# EAGLE design gatilhobaixocusto (EAGLE 7.5.0)
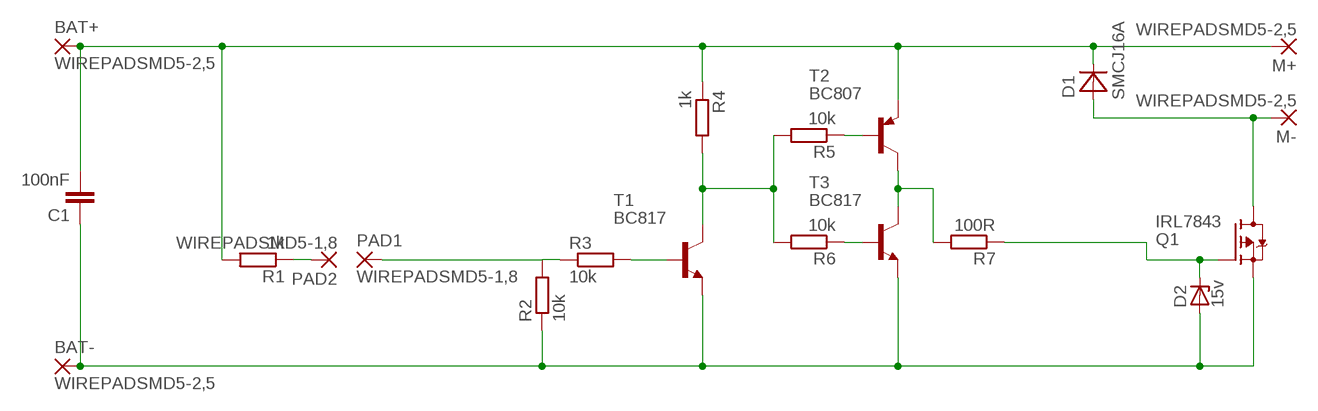
[diagram p0: schematic, sheet 1]

## Parts
BAT+  WIREPADSMD5-2,5  [5-2,5]
BAT-  WIREPADSMD5-2,5  [5-2,5]
C1  100nF  C-EUC0805K  [C0805K]
D1  SMCJ16A  MBRA340T3  [SMA]
D2  15v  ZENER-DIODESOD80C  [SOD80C]
M+  WIREPADSMD5-2,5  [5-2,5]
M-  WIREPADSMD5-2,5  [5-2,5]
PAD1  WIREPADSMD5-1,8  [5-1,8]
PAD2  WIREPADSMD5-1,8  [5-1,8]
Q1  IRL7843  FDD4141TO252  [TO252]
R1  1k  R-EU_R0805  [R0805]
R2  10k  R-EU_R0805  [R0805]
R3  10k  R-EU_R0805  [R0805]
R4  1k  R-EU_R0805  [R0805]
R5  10k  R-EU_R0805  [R0805]
R6  10k  R-EU_R0805  [R0805]
R7  100R  R-EU_R0805  [R0805]
T1  BC817  MMBT3904LT1-NPN-SOT23-BEC  [SOT23-BEC]
T2  BC807  MMBT3906LT1-PNP-SOT23-BEC  [SOT23-BEC]
T3  BC817  MMBT3904LT1-NPN-SOT23-BEC  [SOT23-BEC]

## Nets
N$1: BAT-.1(P) C1.1 D2.A Q1.2(S) R2.1 T1.E T3.E
N$2: D1.A M-.1(P) Q1.3(D)
N$4: PAD2.1(P) R1.1
N$5: BAT+.1(P) C1.2 D1.C M+.1(P) R1.2 R4.1 T2.E
N$7: PAD1.1(P) R2.2 R3.1
N$11: R4.2 R5.2 R6.2 T1.C
N$12: R3.2 T1.B
N$13: R7.2 T2.C T3.C
N$15: R5.1 T2.B
N$16: R6.1 T3.B
N$17: D2.C Q1.1(G) R7.1

## Library data of the parts
BAT+ BAT- M+ M- PAD1 PAD2 = wirepad:WIREPAD: Wire PAD connect wire on PCB
C1 = rcl:C-EU: CAPACITOR, European symbol
D1 = diode:MBRA340T3: Surface Mount Schottky Power Rectifier Source: http://www.onsemi.com/pub_link/Collateral/MBRA340T3-D.PDF
D2 = diode:ZENER-DIODE: Z-Diode
Q1 = transistor-fet:FDD4141: P-Channel PowerTrench® MOSFET Source: FDD4141.pdf
R1-R7 = resistor:R-EU_: RESISTOR, European symbol
T1 T3 = transistor-neu-to92:*-NPN-: NPN Transistror
T2 = transistor:*-PNP-: PNP Transistror

## Board
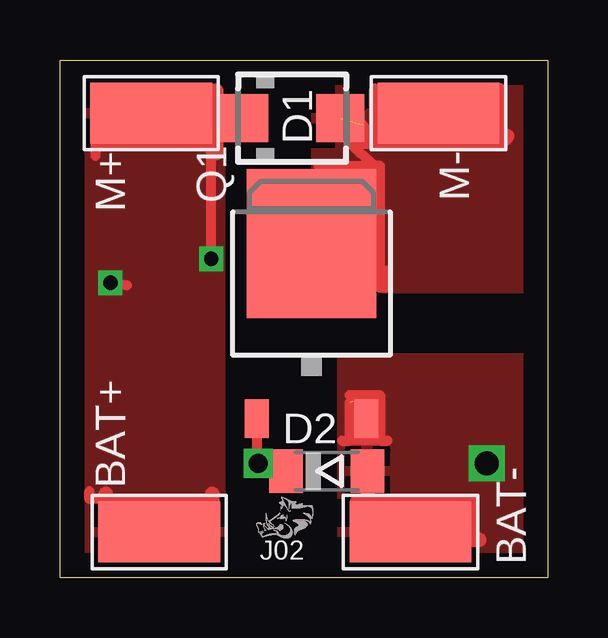
[diagram p1: board, top side]
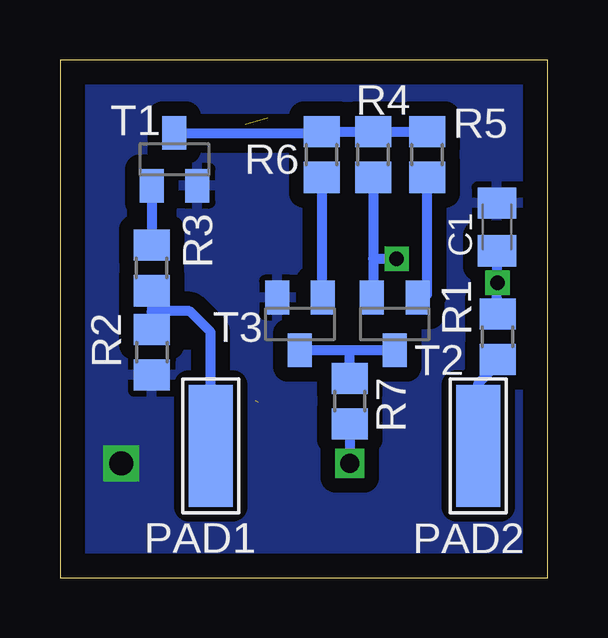
[diagram p2: board, bottom side, seen from below]

Size 20.33 x 21.59 mm. Coordinates in mm from the lower left corner, seen from the top.
Outline: 20.32,21.59 0,21.59 0,0 20.32,0
Outline: 20.33,21.59 20.33,0
Copper layers (1*16): Top 0.035mm / dielectric 1.5mm / Bottom 0.035mm
Design rules "default": minimum track width 10mil, minimum drill 24mil, track to track 8mil, track to pad 8mil, pad to pad 8mil, via to via 8mil, smd to smd 8mil, copper to edge 40mil, drill to drill 8mil, minimum pad ring 10mil, minimum via ring 8mil, stop-mask expansion 4mil, vias tented up to drill 0mil, thermal gap 10mil

### Footprints (pad centres in the part's own frame; a part is rotated, then mirrored left to right if it is on the bottom)
5-2,5 = smd 2.54 x 5.08: 1 0,0
C0805K = smd 1.3 x 1.6: 1 -1,0; 2 1,0
SMA = smd 2 x 2: A 2,0; C -2,0
SOD80C = smd 1.4 x 1.8: A 1.7,0; C -1.7,0
5-1,8 = smd 1.829 x 5.08: 1 0,0
TO252 = smd 1 x 1.6: 1 -2.28,-4.8; 2 2.28,-4.8 | smd 5.4 x 6.2: 3 0,2.5
R0805 = smd 1.3 x 1.5: 1 -0.95,0; 2 0.95,0
SOT23-BEC = smd 1 x 1.4: B -0.95,-1.1; C 0,1.1; E 0.95,-1.1

### Placement (x,y rotation side)
BAT+  4.13,1.91 90 top
BAT-  14.61,1.91 270 top
C1  2.12,14.63 270 bottom
D1  9.67,19.16 0 top
D2  11.11,4.45 0 top
M+  3.81,19.37 90 top
M-  15.77,19.37 270 top
PAD1  14.05,5.5 180 bottom
PAD2  2.9,5.5 0 bottom
Q1  10.48,11.43 0 top
R1  2.09,10.05 90 bottom
R2  16.5,9.4 90 bottom
R3  16.51,12.92 90 bottom
R4  7.29,17.65 90 bottom
R5  5.03,17.65 90 bottom
R6  9.43,17.65 90 bottom
R7  8.26,7.36 90 bottom
T1  15.56,17.45 0 bottom
T2  6.38,10.58 180 bottom
T3  10.33,10.58 180 bottom

### Tracks (layer width: path | path; a pad name or v marks a point on that pad's centre or on a via)
N$1  (via drill 1)  (1 unrouted)
  Top 0.406: 13.34,5.71 13.65,5.71 | 12.06,7.62 13.34,7.62 13.34,5.71 | 13.34,5.71 12.06,5.71 | 12.06,5.71 12.06,7.3 | 11.75,5.71 12.06,5.71 | 12.19,7.37 12.19,7.11
  Top 0.61: 12.38,3.17 12.7,3.17 | 12.7,3.17 17.14,3.17 17.14,1.59 | D2.A 12.81,3.29 12.7,3.17 | 17.14,1.59 17.46,1.59 | 16.83,1.59 17.14,1.59
  other vias: 17.78,4.76
  pour Top: 11.75,0.32 19.37,0.32 19.37,9.14 11.75,9.14
  pour Bottom (isolate 0.61): 19.37,21.27 19.37,0.32 0.64,0.32 0.64,21.27
N$2  (1 unrouted)
  Top 0.406: 10.78,17.18 13.12,17.18 | 12.87,12.69 12.87,12.78 13.6,12.8 13.58,12.08 13.33,12.08 13.33,17.18 13.12,17.18 | 13.1,20.4 13.1,18.4 12.91,18.59 | 13.12,17.18 12.1,18.1 13.3,18.1 | 12.91,18.41 12.91,18.59 | 12.91,18.59 12.6,18.9
  Top 0.61: 18.31,18.1 13.3,18.1 13.23,18.1 13.23,18.41 12.91,18.41 | 18.31,18.1 18.31,20.32 | 18.63,18.41 18.31,18.1
  pour Top: 10.66,21.27 10.64,12.08 19.37,12.08 19.37,21.27
N$4
  Bottom 0.406: PAD2.1 2.9,8.11 2.1,8.9 R1.1
N$5  (via drill 0.6)
  Top 0.406: 1.77,18.25 1.47,18.25 1.47,17.59 | 2.23,3.29 1.22,3.29 1.22,3.61 | 1.5,18 5.5,18 | 5.5,18 6.1,18 | 6.1,18 6.2,18 6.2,17.9 | v6.3,13.3 6.3,17.8 | 6.3,17.8 6.1,18 | D1.C 5.44,19.16 5,19.6 5,18.5 5.5,18 | 6.3,17.8 6.5,17.8 | v2.1,12.3 2.8,12.2
  Top 0.61: 6.35,3.17 4.45,3.17 | 4.45,3.17 1.91,3.17 | BAT+.1 4.13,2.86 4.45,3.17 | 1.91,3.17 1.91,3.49 | 1.91,3.17 1.91,2.86 | 6.35,3.17 6.35,3.49 | 6.35,3.17 6.35,2.86 | 6.5,20.3 6.5,17.8 6.5,17.7
  Bottom 0.406: R4.1 7.29,13.3 | 7.29,13.3 7.29,11.74 T2.E | 7.29,13.3 v6.3,13.3 | R1.2 2.12,11.63 2.12,12.18 v2.1,12.3 2.12,12.22 C1.2
  pour Top: 0.64,0.32 0.64,21.27 6.67,21.27 6.67,0.32
N$7
  Bottom 0.406: R3.1 16.51,11.1 | 16.51,11.1 R2.2 | 16.51,11.1 16.5,11.11 14.92,11.11 14.05,10.24 PAD1.1
N$11
  Bottom 0.406: 15.56,18.09 T1.C 9.38,18.55 R6.2 R4.2 R5.2
N$12
  Bottom 0.406: T1.B 16.51,13.97 R3.2
N$13
  Bottom 0.406: T2.C 8.3,9.48 | 8.3,9.48 T3.C | R7.2 8.26,9.44 8.3,9.48
N$15
  Bottom 0.406: R5.1 5.03,11.79 5.32,11.79 T2.B
N$16
  Bottom 0.406: R6.1 9.43,11.74 T3.B
N$17  (via drill 0.8)
  Top 0.406: Q1.1 8.2,4.82 v8.26,4.76 8.57,4.45 D2.C
  Bottom 0.406: R7.1 v8.26,4.76

### Text on the board
tPlace: J02